# EAGLE design Expander4 (EAGLE 6.3)
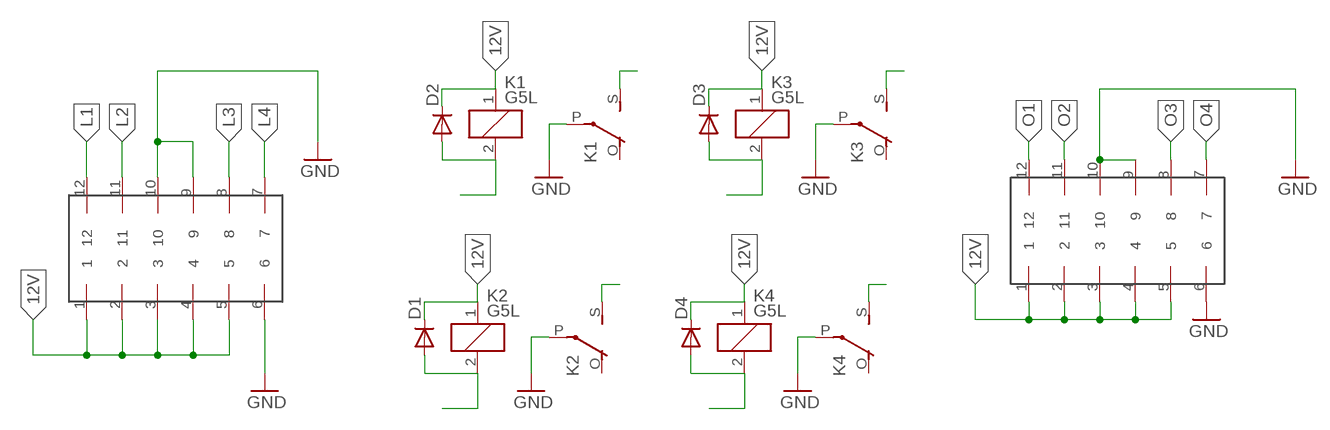
[diagram p0: schematic, sheet 1]

## Parts
D1  DIODESMB  [SMB-DIODE]
D2  DIODESMB  [SMB-DIODE]
D3  DIODESMB  [SMB-DIODE]
D4  DIODESMB  [SMB-DIODE]
IN  MF42-10  [MF42-10]
K1  G5L  [G5LE]
K2  G5L  [G5LE]
K3  G5L  [G5LE]
K4  G5L  [G5LE]
OUT  MF42-10  [MF42-10]

## Nets
12V: D1.C D2.C D3.C D4.C IN.1 IN.2 IN.3 IN.4 IN.5 K1.1 K2.1 K3.1 K4.1 OUT.1 OUT.2 OUT.3 OUT.4 OUT.5
GND: IN.6 IN.9 IN.10 K1.P(2:P) K2.P(2:P) K3.P(2:P) K4.P(2:P) OUT.6 OUT.9 OUT.10
L1: D2.A IN.12 K1.2
L2: D1.A IN.11 K2.2
L3: D3.A IN.8 K3.2
L4: D4.A IN.7 K4.2
O1: K1.S(2:S) OUT.12
O2: K2.S(2:S) OUT.11
O3: K3.S(2:S) OUT.8
O4: K4.S(2:S) OUT.7
Unconnected: K1.O(2:O) K2.O(2:O) K3.O(2:O) K4.O(2:O)

## Library data of the parts
D1-D4 = SparkFun-DiscreteSemi:DIODE: Diode These are standard reverse protection diodes and small signal diodes. SMA package can handle up to about 1A. SOD-323 can handle about 200mA. What the SOD-323 package when ordering, there are some mfgs out there that are 5-pin packages.
IN OUT = con-amphenol:MF42-10
K1-K4 = relay:G5L: RELAY 1 x switch, 10 A/120 V AC, 8 A/30 V ADC, Omron; OC_FARNELL: unknown; OC_NEWARK: unknown

## Board
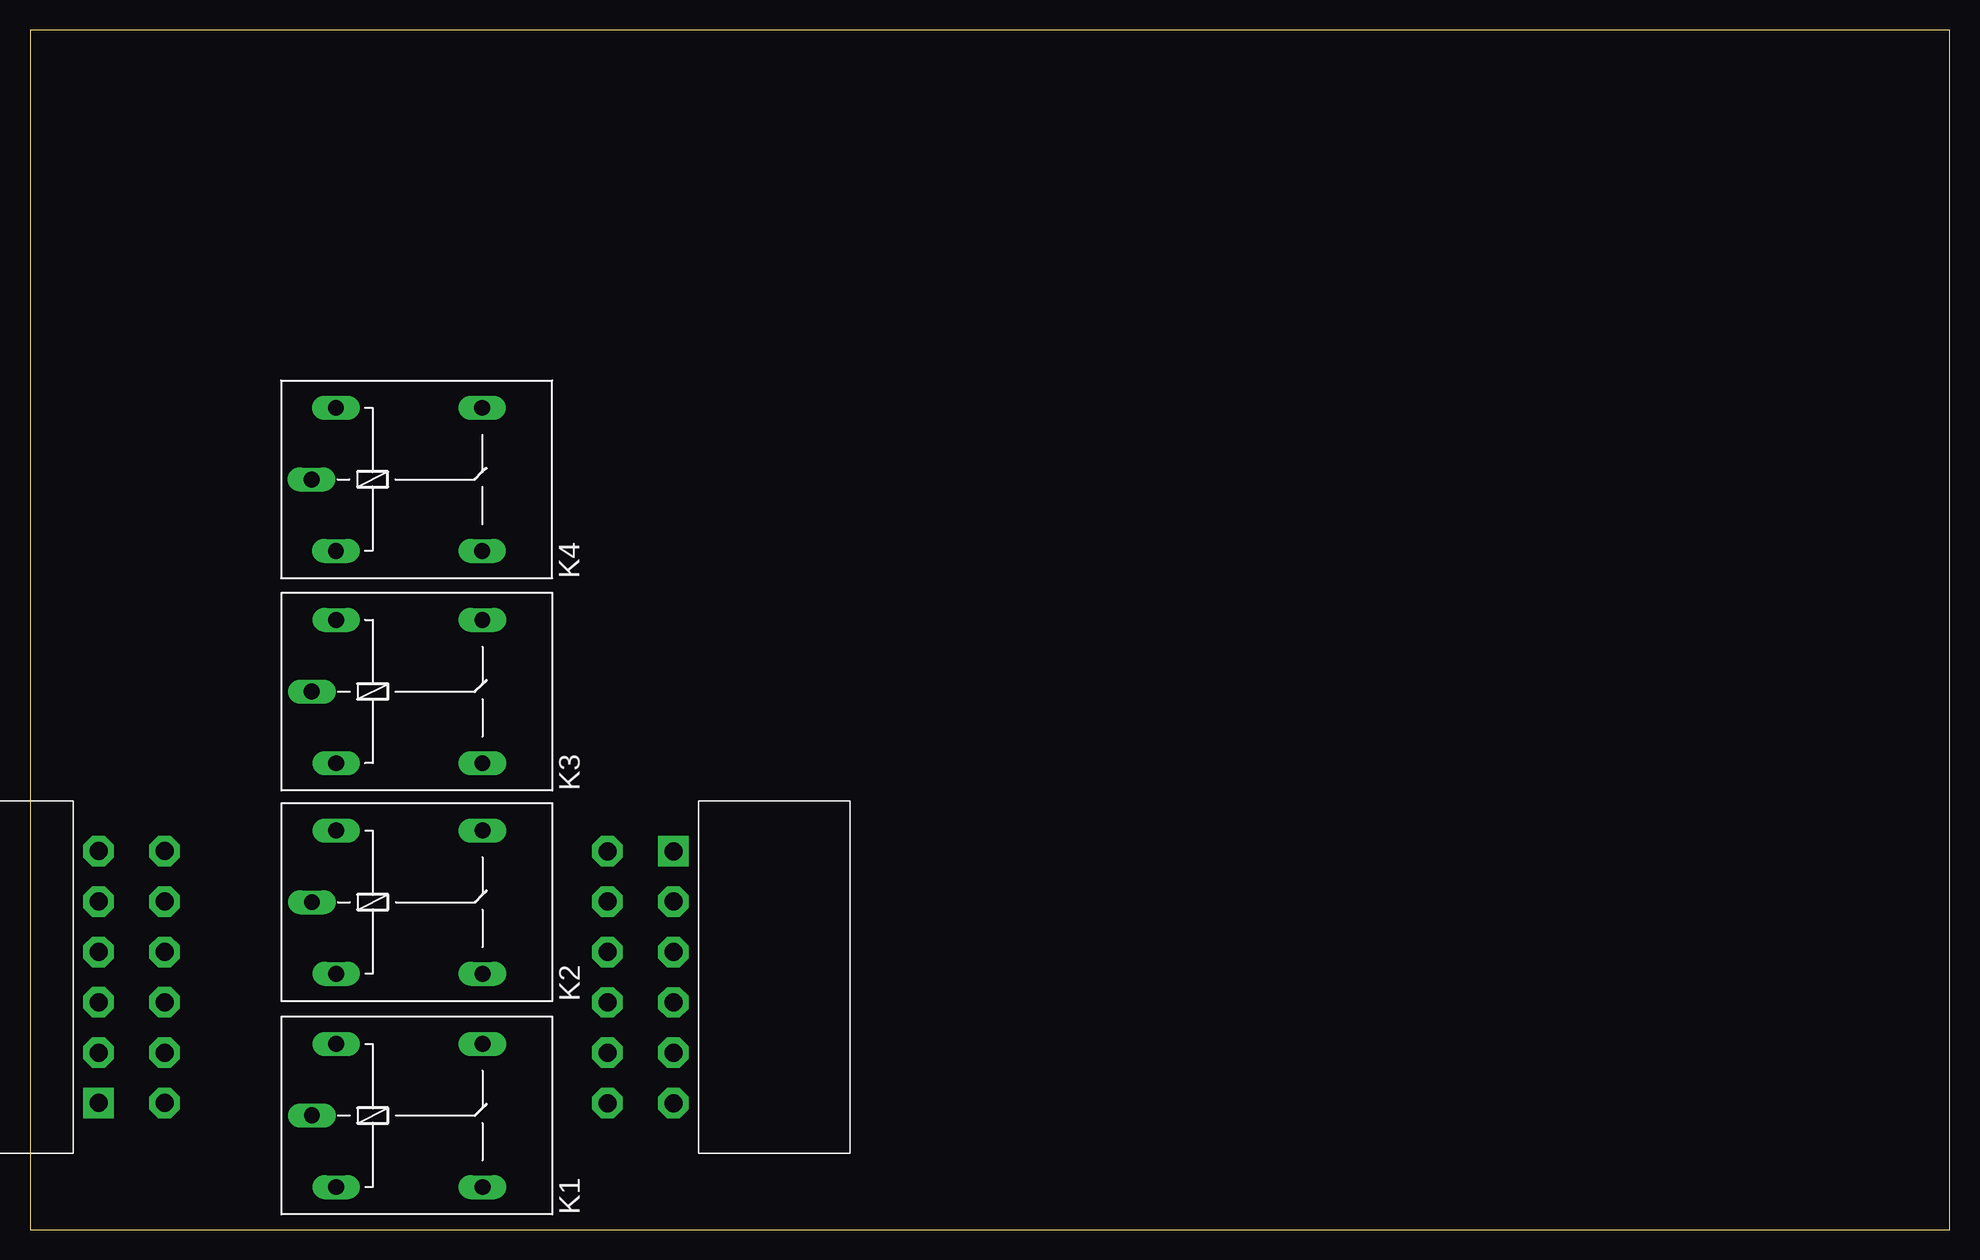
[diagram p1: board, top side]
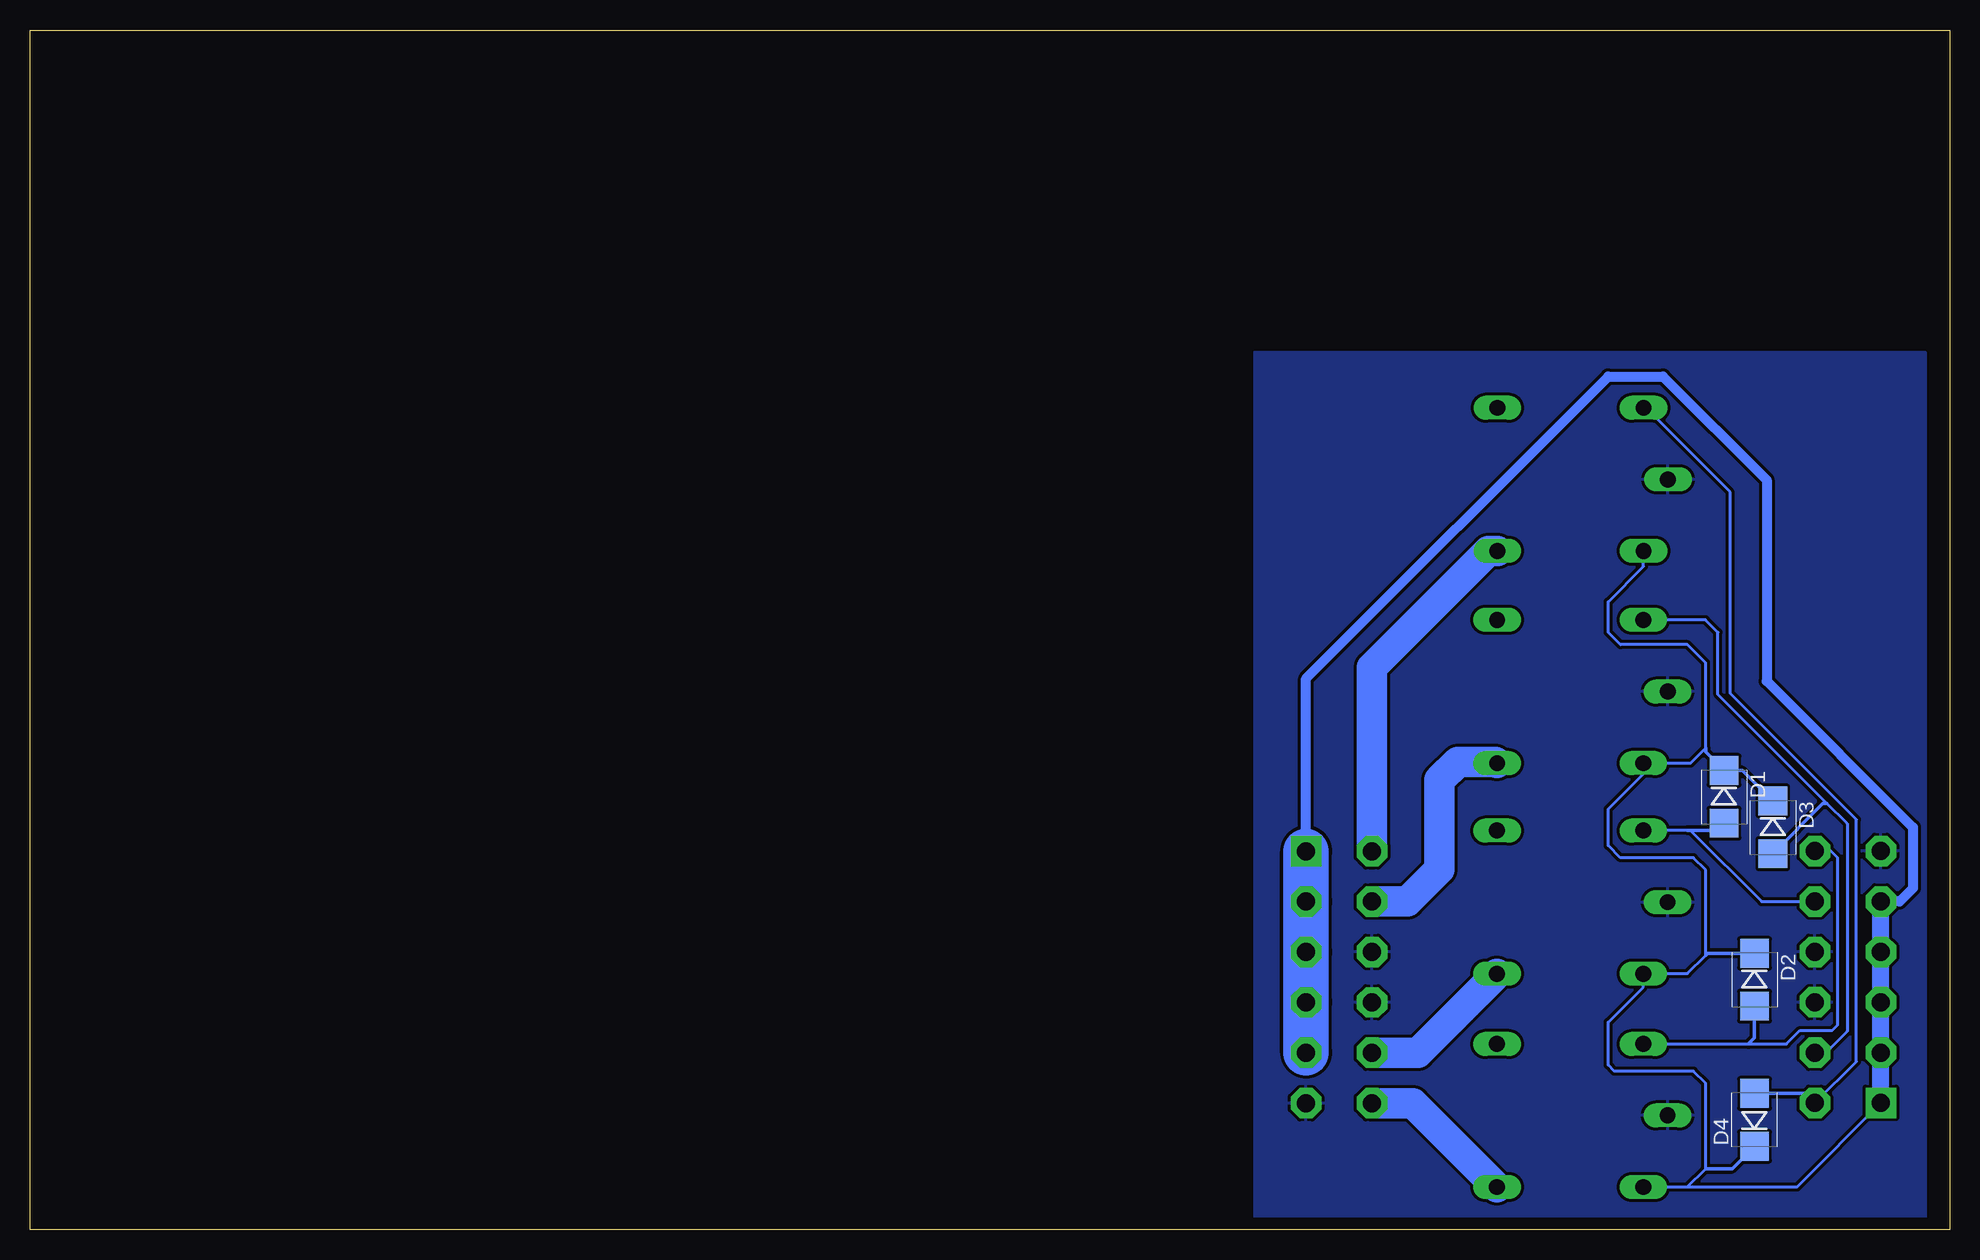
[diagram p2: board, bottom side, seen from below]

Size 160 x 100 mm. Coordinates in mm from the lower left corner, seen from the top.
Outline: 0,0 160,0 160,100 0,100 0,0
Copper layers (1*16): Top 0.035mm / dielectric 1.5mm / Bottom 0.035mm
Design rules "default": minimum track width 10mil, minimum drill 24mil, track to track 8mil, track to pad 8mil, pad to pad 8mil, via to via 8mil, smd to smd 8mil, copper to edge 40mil, drill to drill 8mil, minimum pad ring 10mil, minimum via ring 8mil, stop-mask expansion 4mil, vias tented up to drill 0mil, thermal gap 10mil

### Footprints (pad centres in the part's own frame; a part is rotated, then mirrored left to right if it is on the bottom)
SMB-DIODE = smd 2.4 x 2.4: A 2.2,0; C -2.2,0
MF42-10 = drill 1.5 pad 2.54 square: 1 16.8,0 | drill 1.5 pad 2.54 octagon: 2 12.6,0; 3 8.4,0; 4 4.2,0; 5 0,0; 6 -4.2,0; 7 16.8,5.5; 8 12.6,5.5; 9 8.4,5.5; 10 4.2,5.5; 11 0,5.5; 12 -4.2,5.5
G5LE = drill 1.321 long: 1 -7.493,-5.969; 2 -7.493,5.969; O 4.699,5.969; P -9.525,0; S 4.699,-5.969

### Placement (x,y rotation side)
D1  18.8,36.07 270 bottom
D2  16.26,20.83 270 bottom
D3  14.73,33.53 270 bottom
D4  16.26,9.14 90 bottom
IN  5.71,27.34 270 top
K1  33.02,9.51 0 top
K2  33.02,27.29 0 top
K3  33.02,44.85 0 top
K4  32.99,62.53 0 top
OUT  53.63,14.74 90 top

### Tracks (layer width: path | path; a pad name or v marks a point on that pad's centre or on a via)
12V
  Bottom 0.254: K4.1 25.5,55.27 28.45,52.32 28.45,49.78 27.43,48.77 21.84,48.77 20.32,47.24 20.32,40.13 21.57,38.88 K3.1 25.52,37.98 28.45,35.05 28.45,32 27.43,30.99 21.34,30.99 20.32,29.97 20.32,22.86 21.84,21.34 25.51,21.34 K2.1 25.53,20.19 28.45,17.27 28.45,13.72 27.94,13.21 21.34,13.21 20.32,12.19 20.32,5.08 21.84,3.56 25.51,3.56 K1.1 12.72,3.54 IN.1
  Bottom 0.305: D3.C 17.27,38.27 D1.C 20.32,39.79 20.32,40.13 | D2.C 20.15,23.03 20.32,22.86 | 20.32,5.08 18.12,5.08 D4.C
  Bottom 0.813: OUT.1 53.63,45.93 28.45,71.12 23.88,71.12 15.24,62.48 15.24,45.72 3.05,33.53 3.05,28.45 4.15,27.34 IN.5
  Bottom 1.422: IN.1 IN.2 IN.3 IN.4 IN.5
  Bottom 3.81: OUT.5 OUT.4 OUT.3 OUT.2 OUT.1
GND
  pour Bottom (isolate 0.254): 2.03,0 57.91,0 57.91,73.15 2.03,73.15
L1
  Bottom 0.254: K1.2 16.76,15.48 13.6,15.48 12.47,16.6 9.78,16.6 9.33,17.05 9.33,31 9.88,31.55 IN.12
  Bottom 0.305: D2.A 16.26,15.99 16.76,15.48
L2
  Bottom 0.254: K2.2 25.5,33.28 21.84,33.28 21.6,33.28 15.66,27.34 IN.11
  Bottom 0.305: D1.A 19.38,33.28 21.84,33.28
L3
  Bottom 0.254: IN.8 10.32,14.74 8.54,16.52 8.54,33.83 10.21,35.51 19.3,44.6 19.3,49.78 20.34,50.82 K3.2
  Bottom 0.305: D3.A 10.55,35.51 10.21,35.51
L4
  Bottom 0.254: IN.7 7.76,14 7.76,34.18 18.29,44.7 18.29,61.47 25.32,68.5 K4.2
  Bottom 0.305: D4.A 12.01,11.34 IN.7
O1
  Bottom 2.54: K1.S 44.72,10.54 OUT.12
O2
  Bottom 2.54: K2.S 44.3,14.74 OUT.11
O3
  Bottom 2.54: K3.S 37.84,39 41,39 42.51,37.49 42.51,30.01 45.18,27.34 OUT.8
O4
  Bottom 2.54: K4.S 38.44,56.56 48.13,46.87 OUT.7